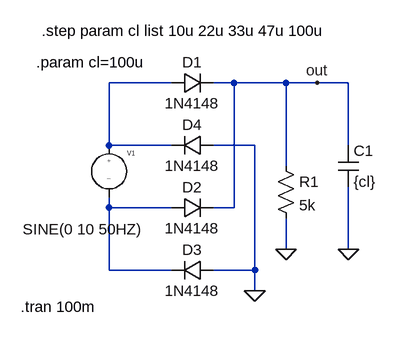
[diagram p0: schematic gleichrichter-graetz.asc]
gleichrichter-graetz.asc, the LTspice schematic file:
Version 4
SHEET 1 880 680
WIRE 128 80 32 80
WIRE 224 80 192 80
WIRE 304 80 224 80
WIRE 352 80 304 80
WIRE 400 80 352 80
WIRE 32 176 32 80
WIRE 128 176 32 176
WIRE 256 176 192 176
WIRE 400 176 400 80
WIRE 304 208 304 80
WIRE 32 272 32 256
WIRE 128 272 32 272
WIRE 224 272 224 80
WIRE 224 272 192 272
WIRE 304 336 304 288
WIRE 400 336 400 240
WIRE 32 368 32 272
WIRE 128 368 32 368
WIRE 256 368 256 176
WIRE 256 368 192 368
WIRE 256 400 256 368
FLAG 256 400 0
FLAG 304 336 0
FLAG 400 336 0
FLAG 352 80 out
SYMBOL diode 128 96 R270
WINDOW 0 32 32 VTop 2
WINDOW 3 0 32 VBottom 2
SYMATTR InstName D1
SYMATTR Value 1N4148
SYMBOL diode 192 160 R90
WINDOW 0 0 32 VBottom 2
WINDOW 3 32 32 VTop 2
SYMATTR InstName D4
SYMATTR Value 1N4148
SYMBOL diode 128 288 R270
WINDOW 0 32 32 VTop 2
WINDOW 3 0 32 VBottom 2
SYMATTR InstName D2
SYMATTR Value 1N4148
SYMBOL diode 192 352 R90
WINDOW 0 0 32 VBottom 2
WINDOW 3 32 32 VTop 2
SYMATTR InstName D3
SYMATTR Value 1N4148
SYMBOL res 288 192 R0
SYMATTR InstName R1
SYMATTR Value 5k
SYMBOL cap 384 176 R0
SYMATTR InstName C1
SYMATTR Value {cl}
SYMBOL source-V 32 160 R0
WINDOW 3 -133 145 Left 2
WINDOW 123 0 0 Left 2
WINDOW 39 0 0 Left 2
SYMATTR Value SINE(0 10 50HZ)
SYMATTR InstName V1
TEXT -80 48 Left 2 !.param cl=100u
TEXT -104 424 Left 2 !.tran 100m
TEXT -72 0 Left 2 !.step param cl list 10u 22u 33u 47u 100u

The netlist it stands for:
* gleichrichter-graetz.asc
D1 N001 out 1N4148
D4 0 N001 1N4148
D2 N002 out 1N4148
D3 0 N002 1N4148
R1 out 0 5k
C1 out 0 {cl}
V1 N001 N002 SINE(0 10 50HZ)
.model D D
.lib standard.dio
.param cl=100u
.tran 100m
.step param cl list 10u 22u 33u 47u 100u
.backanno
.end